# Altium project cfhcgfhcg.PrjPcb
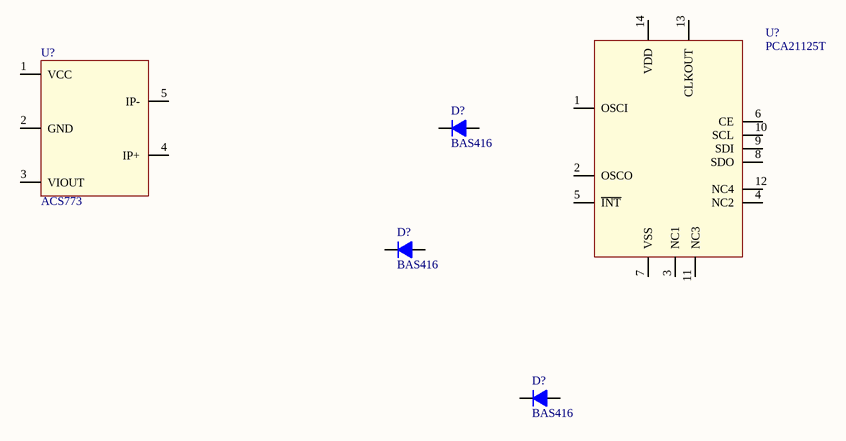
[diagram p0: Sheet1.SchDoc]
1 sheet, 5 parts. Net scope: global (net labels, ports and power ports of the same name join across sheets).

## Sheet Sheet1.SchDoc
size A4

### Parts
(Parts that share a designator on the sheet are numbered #1, #2 ... from top to bottom, then left to right.)
D?#1  BAS416  [SOD-323]
D?#2  BAS416  [SOD-323]
D?#3  BAS416  [SOD-323]
U?#1  ACS773  [CB-PFF]
U?#2  PCA21125T  [TSSOP-14]

### Nets

Not connected (* = marked no-connect by the designer): D?#1 1(A) 2(K); D?#2 1(A) 2(K); D?#3 1(A) 2(K); U?#1 1(VCC) 2(GND) 3(VIOUT) 4(IP+) 5(IP-); U?#2 1(OSCI) 2(OSCO) 3(NC1) 4(NC2) 5(~{INT}) 6(CE) 7(VSS) 8(SDO) 9(SDI) 10(SCL) 11(NC3) 12(NC4) 13(CLKOUT) 14(VDD)

### Library data of the parts
D?#1-D?#3 = BAS416: AEC Low leakage diode; producent: nexperia; part_number: BAS416
U?#1 = ACS773: High Accuracy, Hall-Effect-Based, 200 kHz Bandwidth, Galvanically Isolated Current Sensor IC with 100 μΩ Current Conductor; part_number: ACS773ECB-200B-PFF-T; producent: allegro_micro_systems; id_ac: *
U?#2 = PCA21125T: AEC Real Time Clock IC CLOCK/CALENDAR RTC IC; part_number: PCA21125T/Q900/1,1; producent: nxp; id_ac: *

## Assembly variants
rewrwer: all parts fitted